# EasyEDA schematic Thermocouple Schematic.json
TITLE: Sheet_1; REV: 1.0; Date: 2024-01-16; Sheet: 1/1; Drawn By: akshsable96; Company: Your Company
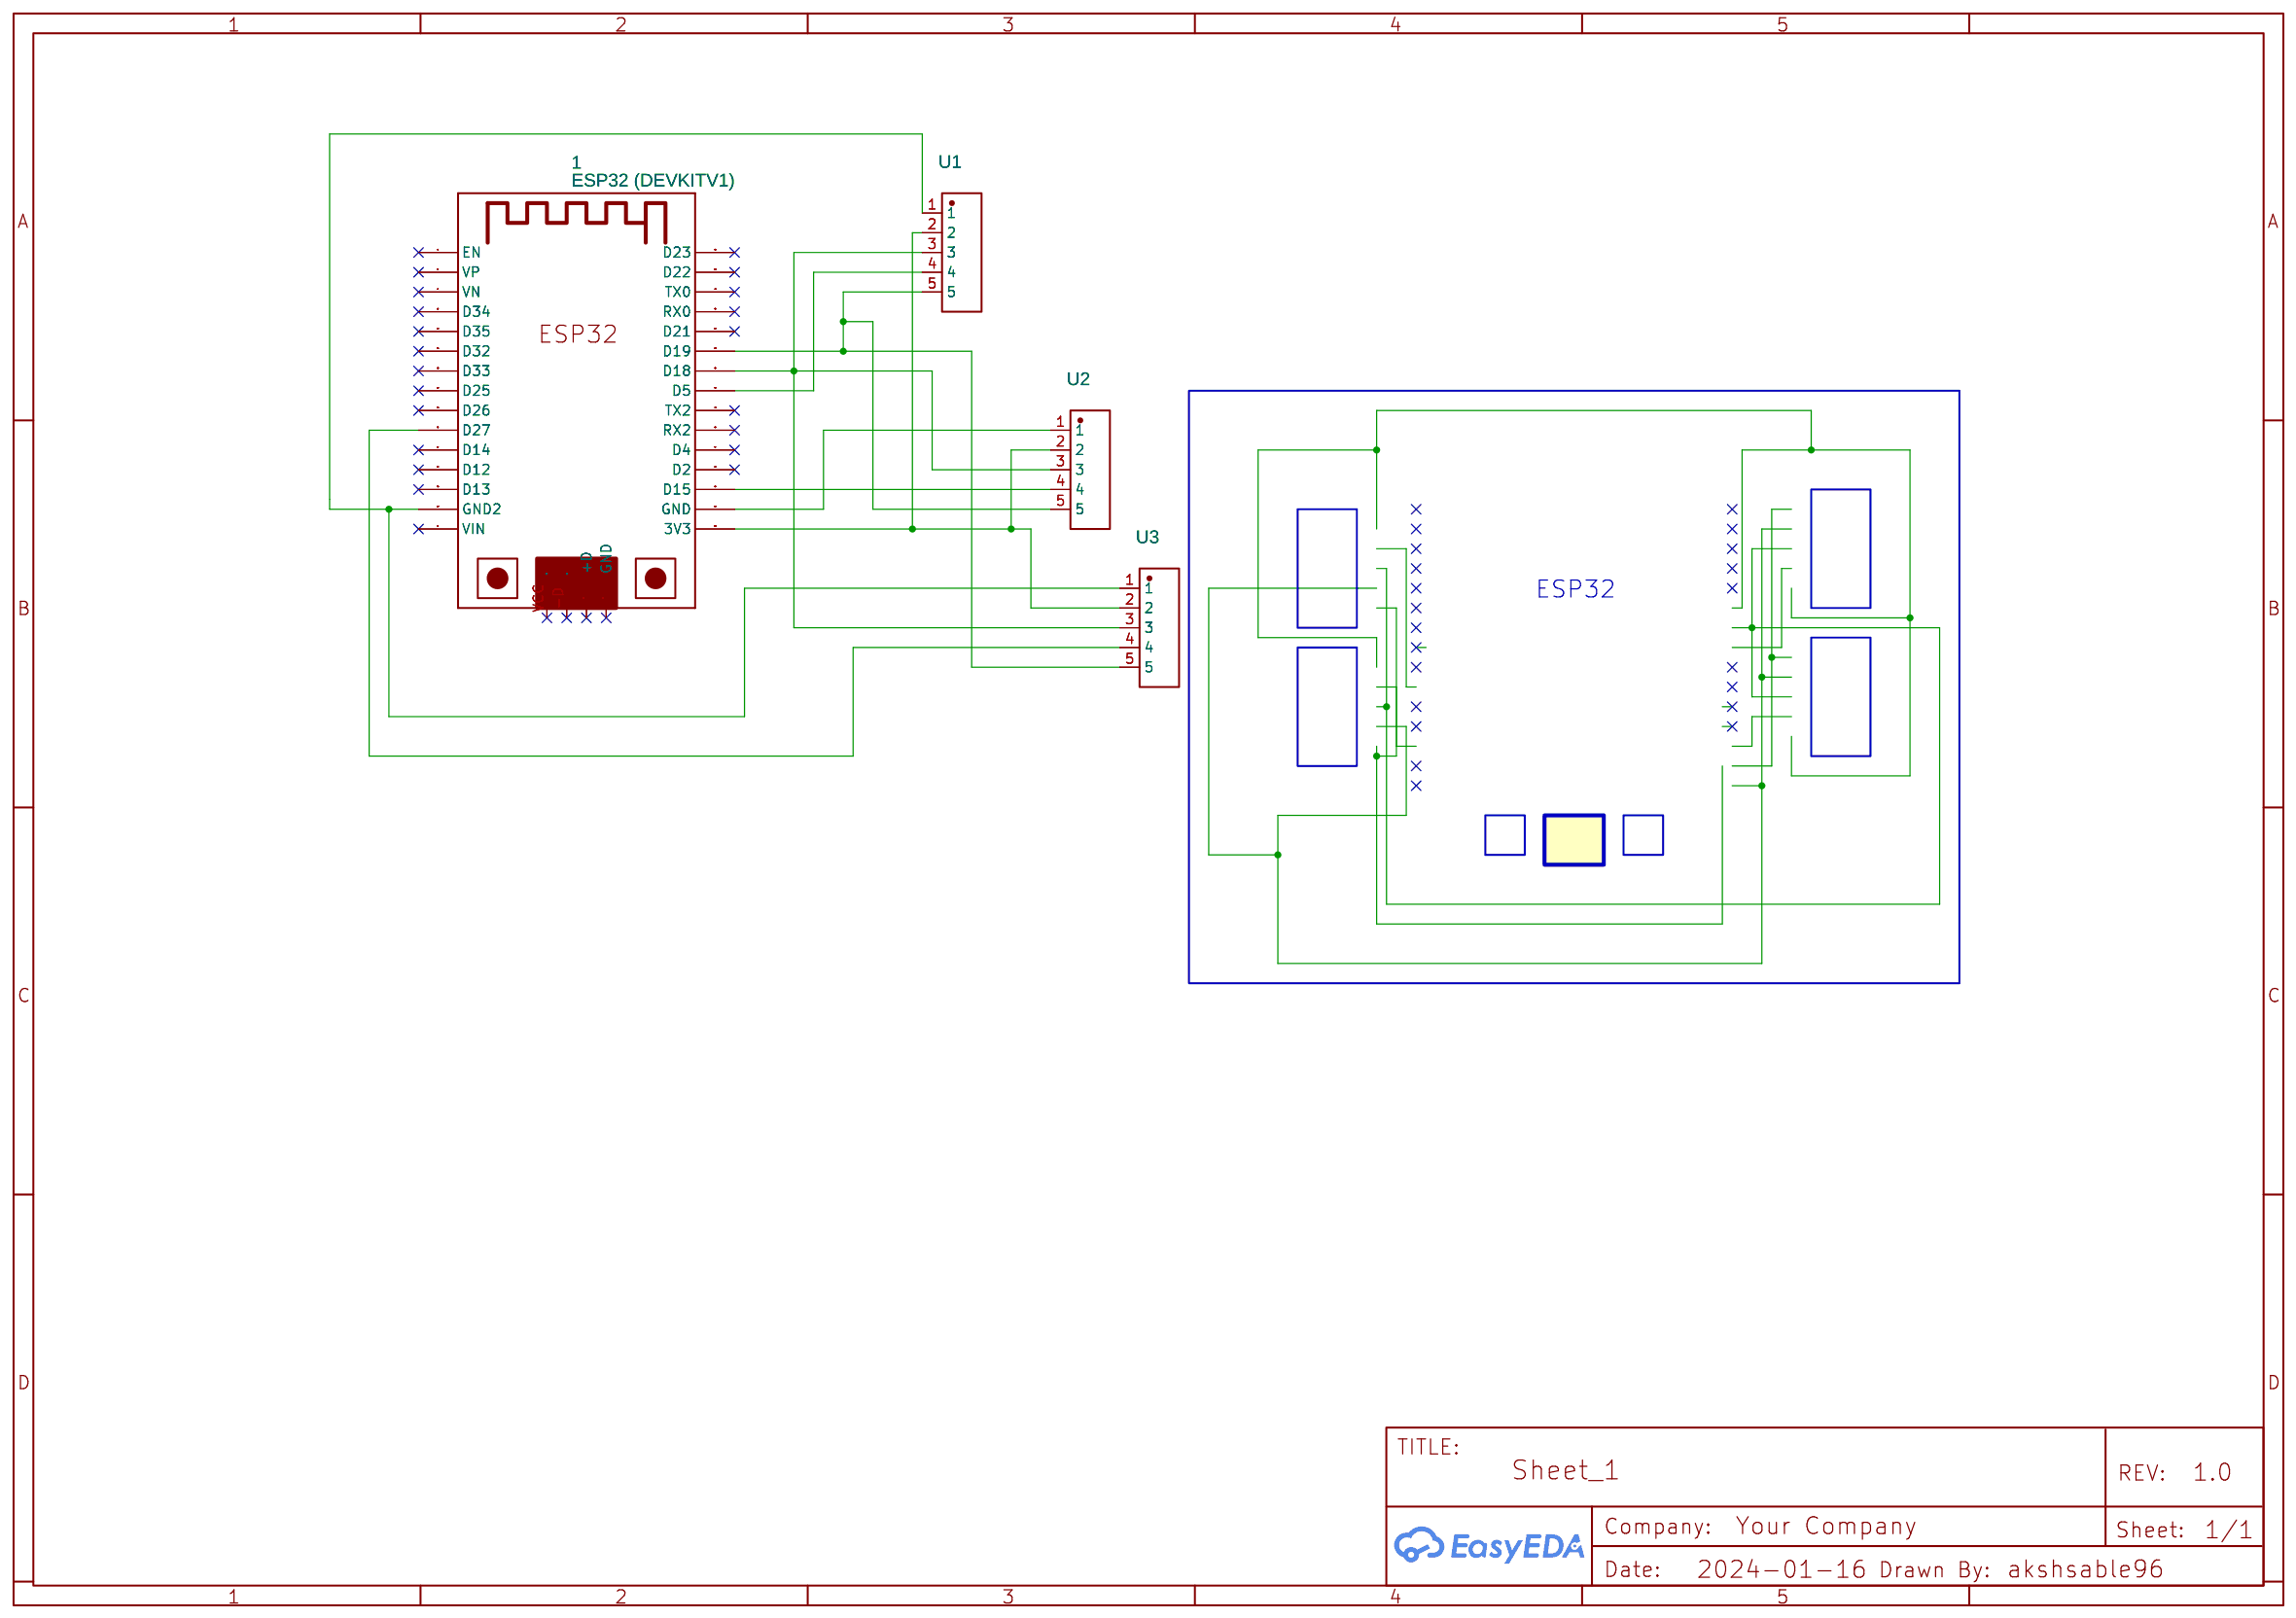
[diagram p0: schematic sheet]

## Parts
1  ESP32 (DEVKITV1)  [ESP32-DEVKITV1_ESP32-DEVKITV1]
U1  PM2.54-1*5  [HDR-TH_5P-P2.54-V-F]
U2  PM2.54-1*5  [HDR-TH_5P-P2.54-V-F]
U3  PM2.54-1*5  [HDR-TH_5P-P2.54-V-F]

## Library data of the parts
1 = ESP32-DEVKIT-V1-30PIN: Contributor: udana
U1-U3 = PM2.54-1*5: Contributor: lcsc; Supplier: LCSC; Supplier Part: C5116488; Manufacturer: ZHOURI(洲日); JLCPCB Part Class: Extended Part

## Nets
Net-(1-3V3): 1.3V3 U1.2 U2.2 U3.2
Net-(1-D5): 1.D5 U1.4
Net-(1-D15): 1.D15 U2.4
Net-(1-D18): 1.D18 U1.3 U2.3 U3.3
Net-(1-D19): 1.D19 U1.5 U2.5 U3.5
Net-(1-D27): 1.D27 U3.4
Net-(1-GND2): 1.GND2 U1.1 U3.1
Net-(1-GND): 1.GND U2.1

Not connected (* = marked no-connect by the designer): 1 38(+D)* 39(GND)* -D(37)* D2* D4* D12* D13* D14* D21* D22* D23* D25* D26* D32* D33* D34* D35* EN* RX0* RX2* TX0* TX2* VCC(36)* VIN* VN* VP*

## Notes on the sheet
- ESP32
